# EAGLE design prod5 (EAGLE 6.5.0)
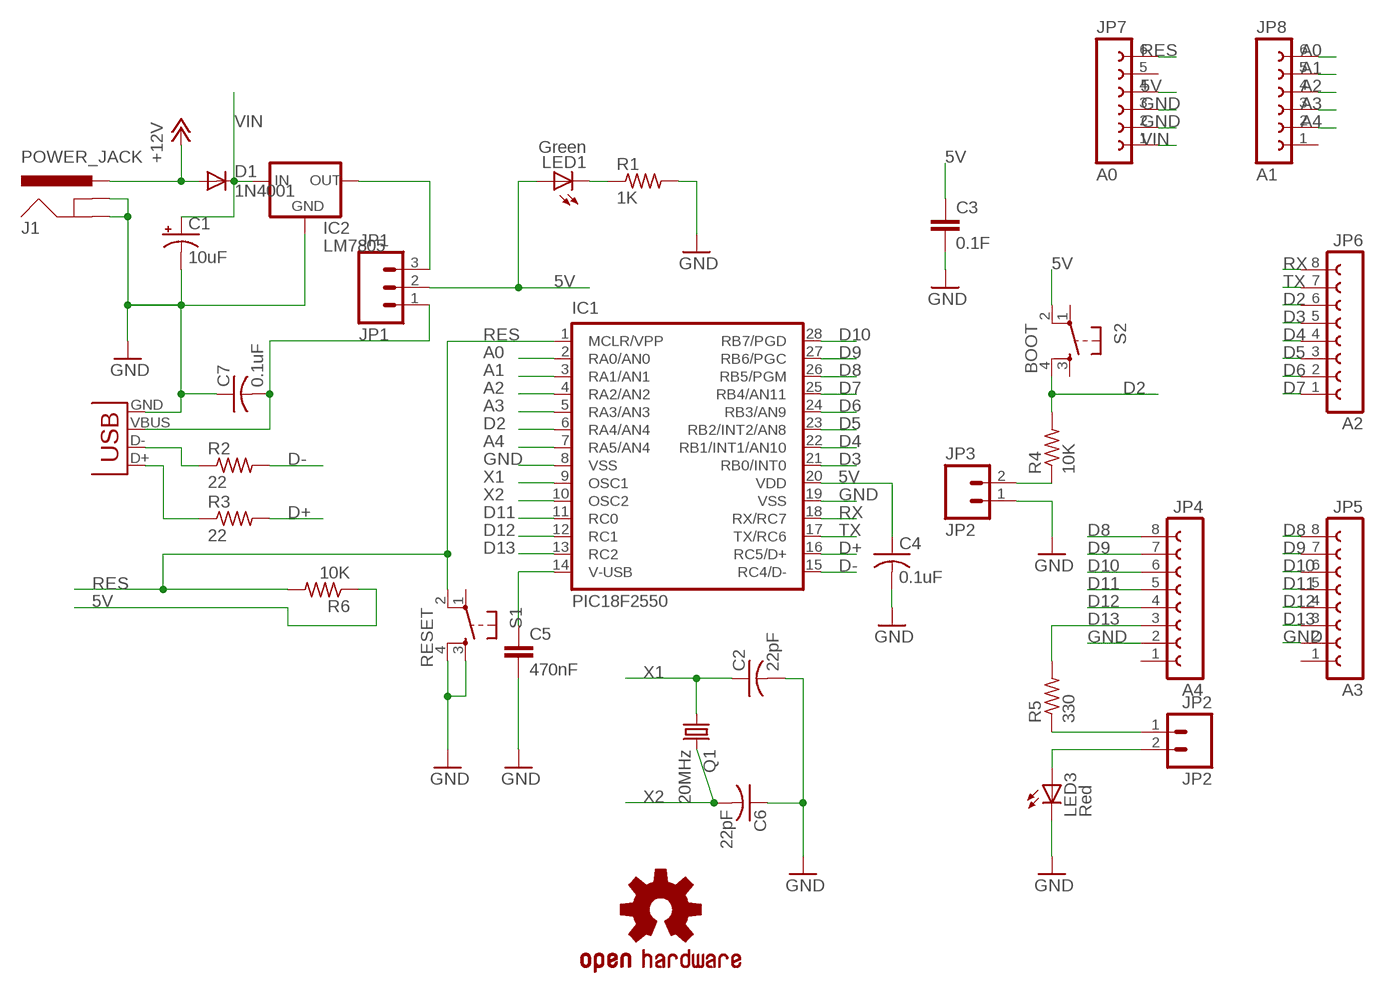
[diagram p0: schematic, sheet 1]

## Parts
C1  10uF  CAP_POLPTH2  [CPOL-RADIAL-10UF-25V]
C2  22pF  C-US025-025X050  [C025-025X050]
C3  0.1F  CAPPTH1  [CAP-PTH-5MM]
C4  0.1uF  C-US025-025X050  [C025-025X050]
C5  470nF  CAPPTH1  [CAP-PTH-5MM]
C6  22pF  C-US025-025X050  [C025-025X050]
C7  0.1uF  C-US025-025X050  [C025-025X050]
D1  1N4001  DIODEPTH  [DIODE-1N4001]
IC1  PIC18F2550  [DIL28-3]
IC2  LM7805  V_REG_78XXSIDE  [78XXL]
J1  POWER_JACK  POWER_JACKPTH  [POWER_JACK_PTH]
JP1  JP1  M03PTH  [1X03]
JP2  JP2  M02PTH  [1X02]
JP3  JP2  M02PTH  [1X02]
JP4  A4  FE08-1  [FE08]
JP5  A3  FE08-1  [FE08]
JP6  A2  FE08-1  [FE08]
JP7  A0  FE06-1  [FE06]
JP8  A1  FE06-1  [FE06]
LED1  Green  LED3MM  [LED3MM]
LED3  Red  LED3MM  [LED3MM]
LOGO1  OSHW-LOGOM  [OSHW-LOGO-M]
Q1  20MHz  CRYSTALHC49S  [HC49/S]
R1  1K  R-US_0204/7  [0204/7]
R2  22  R-US_0207/15  [0207/15]
R3  22  R-US_0207/15  [0207/15]
R4  10K  R-US_0207/15  [0207/15]
R5  330  R-US_0204/7  [0204/7]
R6  10K  R-US_0204/7  [0204/7]
S1  RESET  TAC_SWITCHPTH  [TACTILE-PTH]
S2  BOOT  TAC_SWITCHPTH  [TACTILE-PTH]
X1  USBPTH  [USB-B-PTH]

## Nets
5V: C3.1 C4.1 IC1.20(VDD) JP1.2 JP7.4 LED1.A R6.1 S2.2
+12V: D1.A J1.PWR
A0: IC1.2(RA0/AN0) JP8.6
A1: IC1.3(RA1/AN1) JP8.5
A2: IC1.4(RA2/AN2) JP8.4
A3: IC1.5(RA3/AN3) JP8.3
A4: IC1.7(RA5/AN4) JP8.2
D2: IC1.6(RA4/AN4) JP6.6 R4.2 S2.4
D3: IC1.21(RB0/INT0) JP6.5
D4: IC1.22(RB1/INT1/AN10) JP6.4
D5: IC1.23(RB2/INT2/AN8) JP6.3
D6: IC1.24(RB3/AN9) JP6.2
D7: IC1.25(RB4/AN11) JP6.1
D8: IC1.26(RB5/PGM) JP4.8 JP5.8
D9: IC1.27(RB6/PGC) JP4.7 JP5.7
D10: IC1.28(RB7/PGD) JP4.6 JP5.6
D11: IC1.11(RC0) JP4.5 JP5.5
D12: IC1.12(RC1) JP4.4 JP5.4
D13: IC1.13(RC2) JP4.3 JP5.3 R5.2
D+: IC1.16(RC5/D+) R3.2
D-: IC1.15(RC4/D-) R2.2
GND: C1.2(-) C2.2 C3.2 C4.2 C5.2 C6.1 C7.1 IC1.8(VSS) IC1.19(VSS) IC2.GND J1.GND J1.GNDBREAK JP3.1 JP4.2 JP5.2 JP7.2 JP7.3 LED3.K(C) R1.2 S1.3 S1.4 X1.GND
N$1: JP3.2 R4.1
N$2: LED1.K(C) R1.1
N$4: C7.2 JP1.1 X1.VBUS
N$5: R2.1 X1.D-
N$6: R3.1 X1.D+
N$8: JP2.1 R5.1
N$10: JP2.2 LED3.A
N$11: IC2.OUT JP1.3
N$15: C5.1 IC1.14(V-USB)
RES: IC1.1(MCLR/VPP) JP7.6 R6.2 S1.2
RX: IC1.18(RX/RC7) JP6.8
TX: IC1.17(TX/RC6) JP6.7
VIN: C1.1(+) D1.C IC2.IN JP7.1
X1: C2.1 IC1.9(OSC1) Q1.1
X2: C6.2 IC1.10(OSC2) Q1.2
Unconnected: JP4.1 JP5.1 JP7.5 JP8.1 S1.1 S2.1 S2.3

## Library data of the parts
C1 = SparkFun:CAP_POL: Capacitor Polarized These are standard SMD and PTH capacitors. Normally 10uF, 47uF, and 100uF in electrolytic and tantalum varieties. Always verify the external diameter of the through hole cap, it varies with capacity, voltage, and manufacturer. The EIA devices should be standard.
C2 C4 C6 C7 = rcl:C-US: CAPACITOR, American symbol
C3 C5 = SparkFun:CAP: Capacitor Standard 0603 ceramic capacitor, and 0.1" leaded capacitor.
D1 = SparkFun:DIODE: Diode These are standard reverse protection diodes and small signal diodes. SMA package can handle up to about 1A. SOD-323 can handle about 200mA. What the SOD-323 package when ordering, there are some mfgs out there that are 5-pin packages.
IC1 = SparkFun:PIC18F2550
IC2 = SparkFun:V_REG_78XX: Voltage Regulator Standard 7805 5V regulator. IGO (Input Ground Output). Spark Fun Electronics SKU : COM-00107
J1 = SparkFun:POWER_JACK: Power Jack This is the standard 5.5mm barrel jack for power. The PTH is the most common, proven, reliable, footprint. All others are experimental. The Slot footprint only works if the mill layer is transmitted to the PCB fab house so be warned. Spark Fun Electronics SKU : PRT-00119. Mating wall wart : TOL-00298 (and others)
JP1 = SparkFun-Connectors:M03: Header 3 Standard 3-pin 0.1" header. Use with straight break away headers (SKU : PRT-00116), right angle break away headers (PRT-00553), swiss pins (PRT-00743), machine pins (PRT-00117), and female headers (PRT-00115). Molex polarized connector foot print use with SKU : PRT-08232 with associated crimp pins and housings.
JP2 JP3 = SparkFun-Connectors:M02: Standard 2-pin 0.1" header. Use with - straight break away headers ( PRT-00116) - right angle break away headers (PRT-00553) - swiss pins (PRT-00743) - machine pins (PRT-00117) - female headers (PRT-00115) Molex polarized connector foot print use with: PRT-08233 with associated crimp pins and housings. 2.54_SCREWTERM for use with PRT-10571. 3.5mm Screw Terminal footprints for PRT-08084 5mm Screw Terminal footprints for use with PRT-08433
JP4-JP6 = con-lsta:FE08-1: FEMALE HEADER
JP7 JP8 = con-lsta:FE06-1: FEMALE HEADER
LED1 LED3 = SparkFun:LED: LEDs Standard schematic elements and footprints for 5mm, 3mm, 1206, and 0603 sized LEDs. 5mm - Spark Fun Electronics SKU : COM-00529 (and others)
LOGO1 = SparkFun-Aesthetics:OSHW-LOGO: Open Source Hardware Logo This logo indicates the piece of hardware it is found on incorporates a OSHW license and/or adheres to the definition of open source hardware found here: http://freedomdefined.org/OSHW
Q1 = crystal:CRYSTAL: CRYSTAL; OC_FARNELL: 1667008; OC_NEWARK: unknown
R1-R6 = rcl:R-US_: RESISTOR, American symbol
S1 S2 = SparkFun:TAC_SWITCH: Momentary Switch Button commonly used for reset or general input. Spark Fun Electronics SKU : COM-00097
X1 = SparkFun:USB: USB Connectors USB-B-PTH is fully proven SKU : PRT-00139 USB-miniB is fully proven SKU : PRT-00587 USB-A-PCB is untested. USB-A-H is throughly reviewed, but untested. Spark Fun Electronics SKU : PRT-00437 USB-B-SMT is throughly reviewed, but untested. Needs silkscreen touching up. USB-A-S has not been used/tested USB-MB-H has not been used/tested

## Board
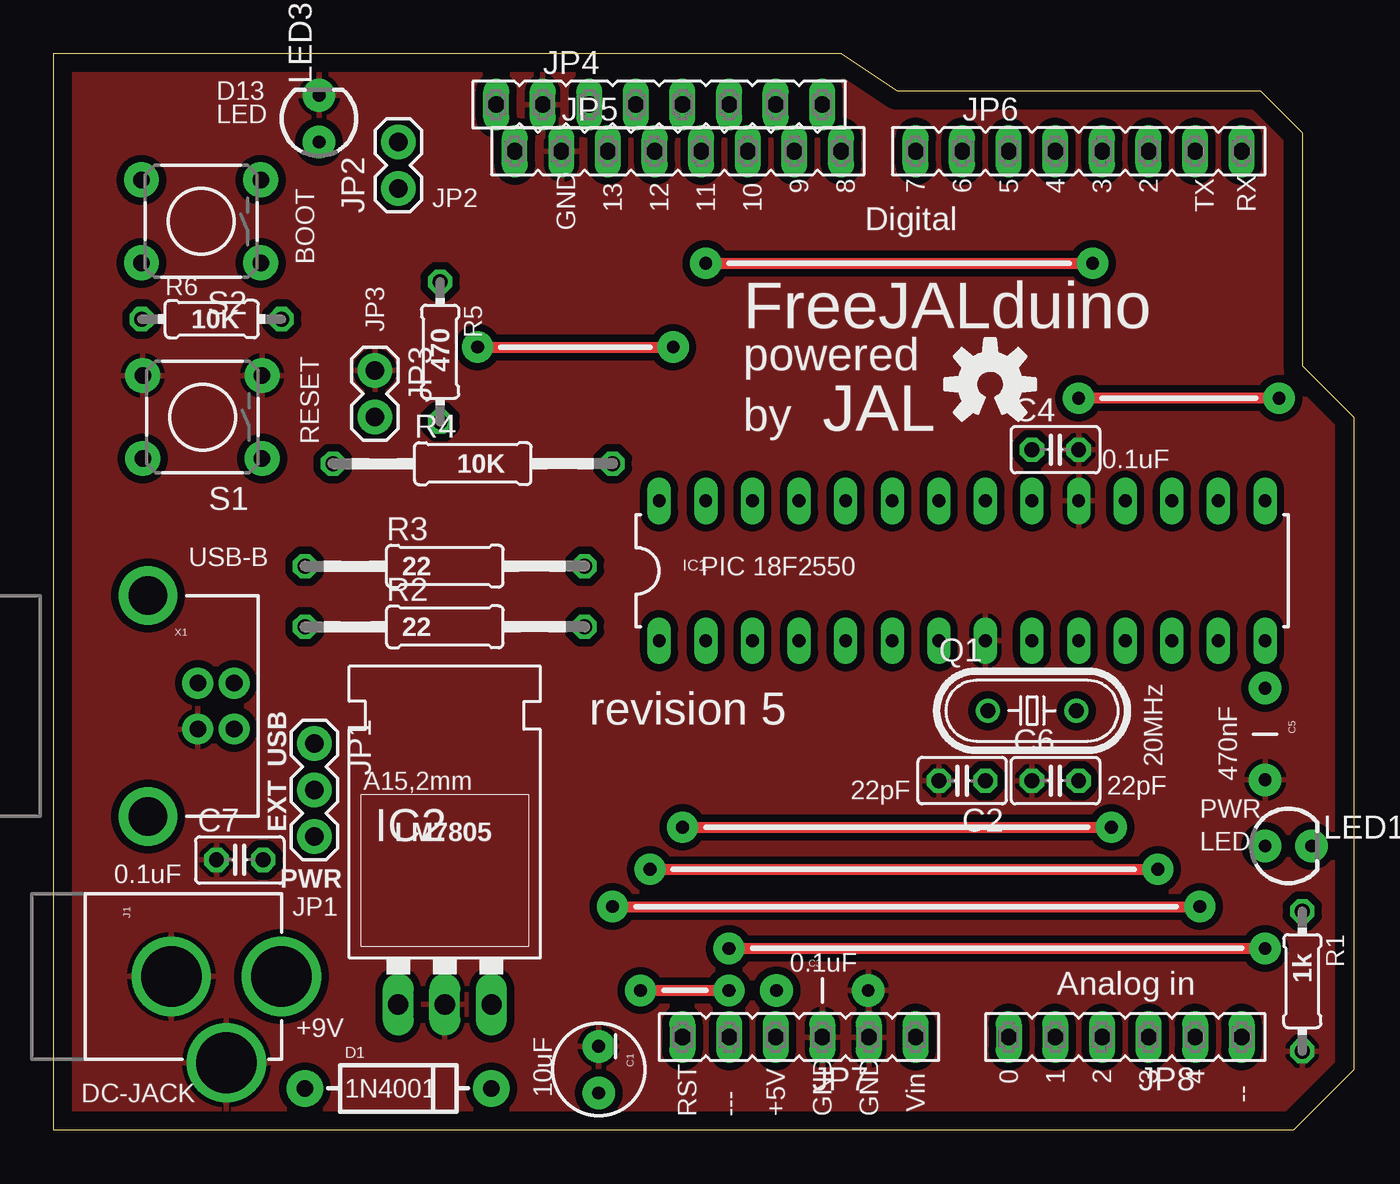
[diagram p1: board, top side]
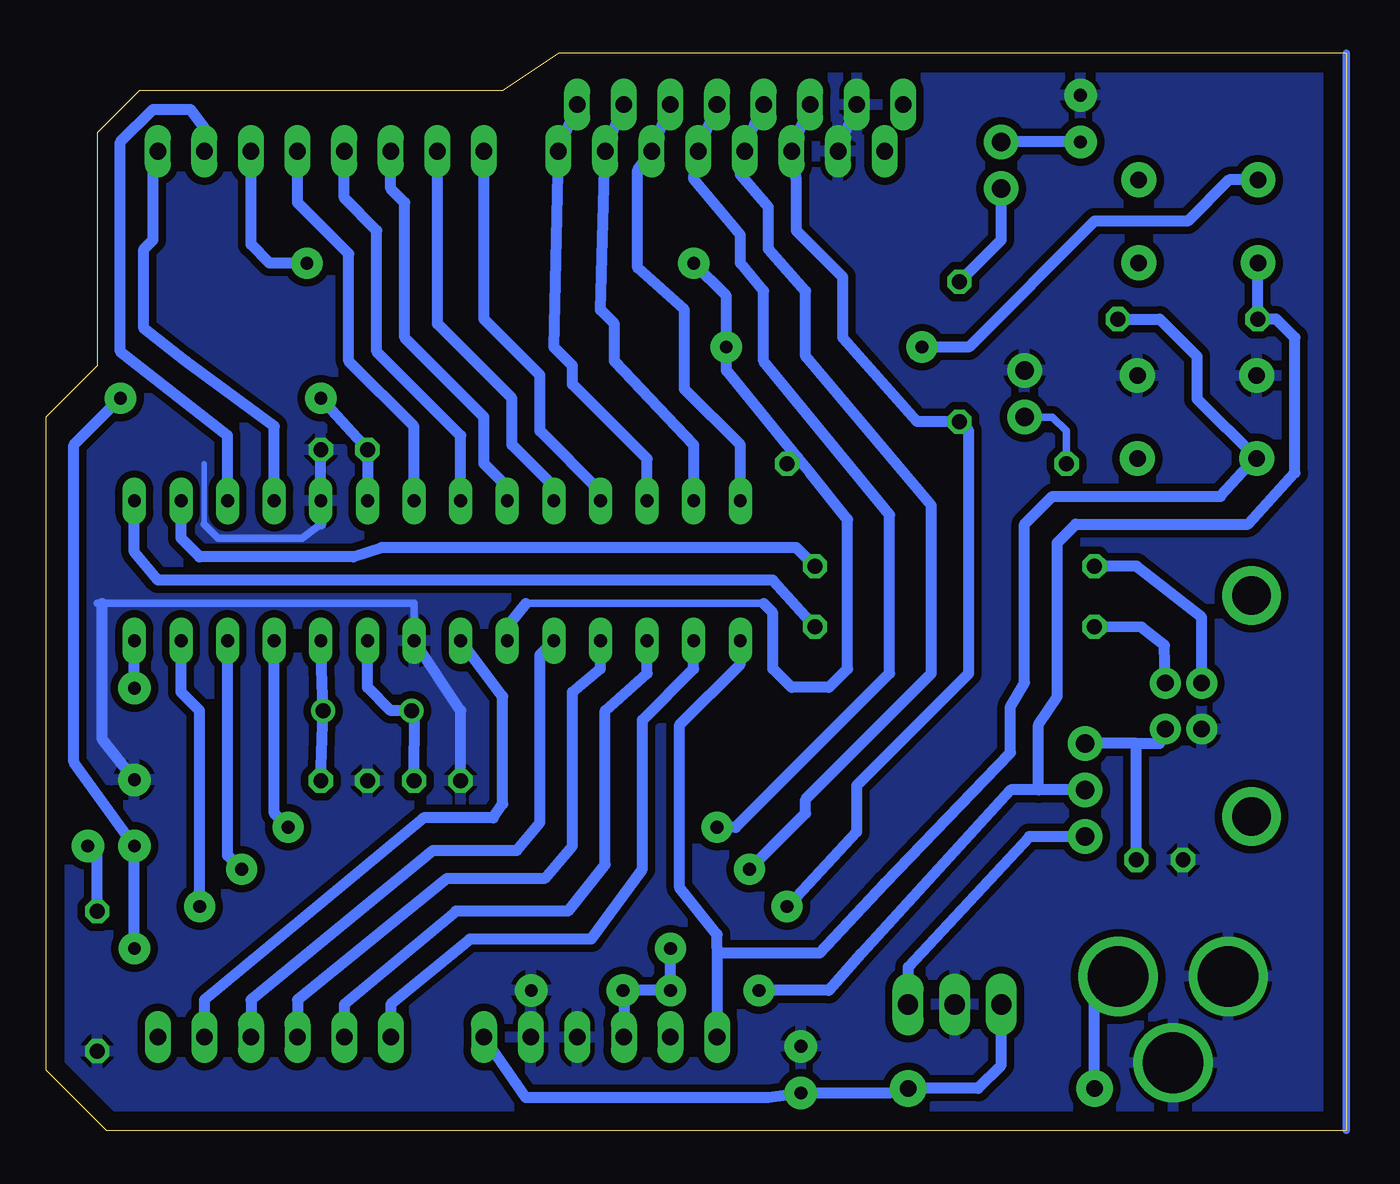
[diagram p2: board, bottom side, seen from below]

Size 70.87 x 58.67 mm. Coordinates in mm from the lower left corner, seen from the top.
Outline: 0,58.67 0,0 67.56,0 70.87,3.3 70.87,38.86 68.07,41.66 68.07,54.36 65.79,56.64 45.97,56.64 42.93,58.67 0,58.67
Copper layers (1*16): Top 0.035mm / dielectric 1.5mm / Bottom 0.035mm
Design rules "10mils *": minimum track width 10mil, minimum drill 24mil, track to track 16mil, track to pad 16mil, pad to pad 16mil, via to via 16mil, smd to smd 10mil, copper to edge 40mil, drill to drill 10mil, minimum pad ring 10mil, minimum via ring 8mil, stop-mask expansion 0mil, vias tented up to drill 0mil, thermal gap 10mil

### Footprints (pad centres in the part's own frame; a part is rotated, then mirrored left to right if it is on the bottom)
CPOL-RADIAL-10UF-25V = drill 0.7 pad 1.778: 1 1.27,0; 2 -1.27,0
C025-025X050 = drill 0.813 octagon: 1 -1.27,0; 2 1.27,0
CAP-PTH-5MM = drill 0.7 pad 1.778: 1 -2.5,0; 2 2.5,0
DIODE-1N4001 = drill 0.9 pad 1.981: A -5.08,0; C 5.08,0
DIL28-3 = drill 0.7 pad 1.27 long: 1 -16.51,-3.81; 2 -13.97,-3.81; 3 -11.43,-3.81; 4 -8.89,-3.81; 5 -6.35,-3.81; 6 -3.81,-3.81; 7 -1.27,-3.81; 8 1.27,-3.81; 9 3.81,-3.81; 10 6.35,-3.81; 11 8.89,-3.81; 12 11.43,-3.81; 13 13.97,-3.81; 14 16.51,-3.81; 15 16.51,3.81; 16 13.97,3.81; 17 11.43,3.81; 18 8.89,3.81; 19 6.35,3.81; 20 3.81,3.81; 21 1.27,3.81; 22 -1.27,3.81; 23 -3.81,3.81; 24 -6.35,3.81; 25 -8.89,3.81; 26 -11.43,3.81; 27 -13.97,3.81; 28 -16.51,3.81
78XXL = drill 1.1 pad 1.676 long: GND 0,-3.81; IN -2.54,-3.81; OUT 2.54,-3.81
POWER_JACK_PTH = drill 3.3 pad 4: GND 0,7.7; GNDBREAK 4.7,10.7; PWR 0,13.7
1X03 = drill 1.016 pad 1.88: 1 -2.54,0; 2 0,0; 3 2.54,0
1X02 = drill 1.016 pad 1.88: 1 -1.27,0; 2 1.27,0
FE08 = drill 0.9 pad 1.422 long: 1 -8.89,0; 2 -6.35,0; 3 -3.81,0; 4 -1.27,0; 5 1.27,0; 6 3.81,0; 7 6.35,0; 8 8.89,0
FE06 = drill 0.9 pad 1.422 long: 1 -6.35,0; 2 -3.81,0; 3 -1.27,0; 4 1.27,0; 5 3.81,0; 6 6.35,0
LED3MM = drill 0.7 pad 1.778: A -1.27,0; K 1.27,0
HC49/S = drill 0.813: 1 -2.413,0; 2 2.413,0
0204/7 = drill 0.813 octagon: 1 -3.81,0; 2 3.81,0
0207/15 = drill 0.813 octagon: 1 -7.62,0; 2 7.62,0
TACTILE-PTH = drill 0.9 pad 1.9: 1 -3.251,2.261; 2 3.251,2.261; 3 -3.251,-2.261; 4 3.251,-2.261
USB-B-PTH = drill 0.9 pad 1.676: D+ 0,1.25; D- 1.981,1.25; GND 0,-1.25; VBUS 1.981,-1.25 | drill 2.1 pad 3.2: P$1 -2.718,-6.02; P$2 -2.718,6.02

### Placement (x,y rotation side)
C1  29.72,3.3 270 top
C2  49.53,19.05 180 top
C3  41.91,7.62 0 top
C4  54.61,37.08 0 top
C5  66.04,21.59 270 top
C6  54.61,19.05 0 top
C7  10.16,14.73 0 top
D1  18.8,2.29 0 top
IC1  49.53,30.48 0 top
IC2  21.34,10.67 0 top
J1  -1.27,8.38 270 top
JP1  14.22,18.54 270 top
JP2  18.8,52.58 90 top
JP3  17.53,40.13 270 top
JP4  33.02,55.88 0 top
JP5  34.04,53.34 0 top
JP6  55.88,53.34 0 top
JP7  40.64,5.08 180 top
JP8  58.42,5.08 180 top
LED1  67.31,15.49 0 top
LED3  14.48,55.12 90 top
LOGO1  51.05,40.64 0 top
Q1  53.34,22.86 0 top
R1  68.07,8.13 270 top
R2  21.34,27.43 0 top
R3  21.34,30.73 0 top
R4  22.86,36.32 0 top
R5  21.08,42.42 270 top
R6  8.64,44.2 0 top
S1  8.13,38.86 180 top
S2  8.05,49.52 180 top
X1  7.87,23.11 0 top

### Tracks (layer width: path | path; a pad name or v marks a point on that pad's centre or on a via)
5V  (via drill 0.7 pad 1.7)
  Top 0.61: C3.1 39.62,7.62 | v32,7.62 v36.83,7.62 | v36.83,9.91 v66.04,9.91 | v66.8,39.88 v55.88,39.88
  Bottom 0.61: IC1.20 C4.1 v55.88,39.88 | JP7.4 39.37,7.58 C3.1 v36.83,7.62 v36.83,9.91 | 16.76,18.54 16.76,22.1 15.75,23.62 15.75,32 14.73,33.02 5.33,33.02 2.79,35.81 2.79,43.18 3.81,44.2 R6.1 4.83,47.23 S2.2 | JP1.2 16.76,18.54 | 16.76,18.54 18.29,18.54 26.42,9.65 28.19,7.62 v32,7.62 | v66.04,9.91 LED1.A 69.34,20.07 69.34,37.34 v66.8,39.88
+12V
  Bottom 0.61: J1.PWR 12.43,8.4 13.72,7.11 D1.A
A0
  Bottom 0.61: IC1.2 35.56,25.15 38.35,22.35 38.35,14.22 41.15,10.41 47.75,10.41 52.07,6.86 JP8.6
A1
  Bottom 0.61: IC1.3 38.1,24.89 40.39,22.86 40.39,14.48 42.42,11.94 48.51,11.94 54.61,6.86 JP8.5
A2
  Bottom 0.61: IC1.4 40.64,25.15 42.16,23.88 42.16,15.49 43.69,13.72 49.02,13.72 57.15,7.11 JP8.4
A3
  Bottom 0.61: JP8.3 59.69,7.11 49.78,15.24 45.21,15.24 43.94,16.76 43.94,25.91 IC1.5
A4
  Bottom 0.61: IC1.7 45.97,23.62 45.97,17.78 46.48,17.02 50.29,17.02 62.23,7.11 JP8.2
D2  (via drill 0.7 pad 1.7)
  Top 0.61: v35.56,47.24 v56.64,47.24 | v23.11,42.67 v33.78,42.67
  Bottom 0.406: 31.75,28.7 44.7,28.7
  Bottom 0.61: IC1.6 45.72,27.43 44.7,28.7 | 31.75,28.7 31.24,28.19 31.24,25.15 30.23,24.13 28.19,24.13 27.18,25.15 27.18,33.27 29.21,35.81 29.87,36.62 | v35.56,47.24 33.78,45.47 v33.78,42.67 33.78,41.4 29.87,36.62 | v56.64,47.24 58.67,47.24 59.69,48.26 JP6.6 | R4.2 30.16,36.32 29.87,36.62 | S2.4 6.39,51.78 8.64,49.53 13.72,49.53 20.57,42.67 v23.11,42.67
D3
  Bottom 0.61: IC1.21 50.8,38.35 54.36,41.91 54.36,47.75 57.15,50.55 JP6.5
D4
  Bottom 0.61: IC1.22 48.26,37.85 52.83,42.42 52.83,49.02 54.61,50.8 JP6.4
D5
  Bottom 0.61: IC1.23 45.72,35.05 46.99,36.32 46.99,38.86 51.31,43.18 51.31,50.55 52.07,51.31 JP6.3
D6
  Bottom 0.61: IC1.24 43.18,35.05 45.47,37.34 45.47,39.88 49.53,43.94 JP6.2
D7
  Bottom 0.61: IC1.25 40.64,34.8 43.94,38.1 43.94,41.15 46.99,44.2 JP6.1
D8
  Bottom 0.61: IC1.26 38.1,36.58 42.16,40.64 42.16,41.66 43.18,42.67 JP5.8 JP4.8
D9
  Bottom 0.61: IC1.27 35.56,37.34 39.88,41.91 39.88,43.94 40.64,44.7 JP5.7 JP4.7
D10
  Bottom 0.61: IC1.28 33.02,37.34 36.07,40.39 36.07,44.7 38.61,46.99 38.61,52.32 JP5.6 JP4.6
D11  (via drill 0.7 pad 1.7)
  Top 0.61: v34.29,16.51 v57.66,16.51
  Bottom 0.61: IC1.11 58.42,17.27 v57.66,16.51 | v34.29,16.51 33.27,16.51 24.89,24.89 24.89,33.53 31.75,41.91 31.75,45.72 33.02,47.24 33.02,48.77 35.56,51.82 JP5.5 JP4.5
D12  (via drill 0.7 pad 1.7)
  Top 0.61: v32.51,14.22 v60.2,14.22
  Bottom 0.61: 32.63,53.93 JP5.4 33.02,52.07 31.5,50.29 31.5,48.01 29.46,45.72 29.46,42.16 22.61,34.04 22.61,24.89 29.46,18.03 29.46,17.27 v32.51,14.22 | 32.63,53.93 32.51,54.1 | IC1.12 60.96,14.99 v60.2,14.22 | 32.63,53.93 JP4.4
D13  (via drill 0.7 pad 1.7)
  Top 0.61: v30.48,12.19 v62.48,12.19
  Bottom 0.61: IC1.13 63.5,23.88 62.48,22.86 v62.48,12.19 | v30.48,12.19 29.97,12.7 26.67,16.26 26.67,18.8 20.57,24.89 20.57,38.1 R5.2 | R5.2 21.2,38.7 21.2,38.61 | 21.2,38.61 23.37,38.61 27.43,43.18 27.43,46.48 29.97,49.02 29.97,51.82 JP5.3 JP4.3 | R5.2 21.2,38.61
D+
  Bottom 0.61: IC1.16 63.5,32.26 62.48,31.24 54.1,31.24 52.58,31.75 29.97,31.75 R3.2
D-
  Bottom 0.61: R2.2 31.24,29.97 64.77,29.97 66.04,31.5 IC1.15
GND
  Bottom 0.305: 62.23,33.02 62.23,36.32
  Bottom 0.406: 55.88,33.02 56.9,32.26 61.47,32.26 62.23,33.02 | IC1.8 50.8,28.7 67.82,28.7 68.07,28.7
  Bottom 0.61: 55.88,33.02 IC1.19 C4.2 | JP7.2 44.41,5.08 | JP5.2 JP4.2 | IC2.GND 21.34,8.13 | 66.04,19.05 C5.2 67.82,21.34 67.82,28.7 | C2.2 48.26,22.86 IC1.8
  pour Bottom (isolate 0.406, hatched): 1.52,0.51 1.52,57.66 70.1,57.66 70.1,3.56 67.06,0.51
  pour Top: 0,58.93 70.36,58.93 70.36,0 0,0
N$1
  Bottom 0.406: R4.1 15.24,38.1 16,38.86 JP3.2
N$2
  Bottom 0.61: R1.1 68.07,15.24 LED1.K
N$4
  Bottom 0.61: 9.91,21.66 X1.VBUS 10.16,21.08 11.43,21.08 | 11.43,21.08 JP1.1 | C7.2 11.43,21.08
N$5
  Bottom 0.61: X1.D- 9.91,26.42 11.16,27.41 R2.1
N$6
  Bottom 0.61: X1.D+ 7.87,27.94 11.43,30.73 R3.1
N$8
  Bottom 0.61: R5.1 18.8,48.51 JP2.1
N$10
  Bottom 0.61: LED3.A JP2.2
N$11
  Bottom 0.61: IC2.OUT 23.88,8.89 17.27,16 JP1.3
N$12
  Bottom 0.406: 0,0 0,58.67
N$15
  Bottom 0.61: C5.1 IC1.14
RES
  Bottom 0.61: IC1.1 33.02,25.4 36.32,22.1 36.32,13.21 34.29,10.67 34.29,9.91 | 34.29,9.91 JP7.6 | 34.29,9.91 34.04,9.65 28.7,9.65 25.15,13.46 18.29,20.57 18.29,23.11 17.53,24.38 17.53,33.02 16,34.54 6.86,34.54 5.03,36.52 S1.2 8.13,39.85 8.13,42.16 10.16,44.2 R6.2
RX
  Bottom 0.61: IC1.18 58.42,38.35 63.25,41.91 65.53,43.69 65.53,48.01 65.02,48.51 65.02,53.09 JP6.8
TX
  Bottom 0.61: IC1.17 60.96,37.85 66.8,42.42 66.8,53.85 65.02,55.63 62.99,55.63 62.23,54.61 JP6.7
VIN
  Bottom 0.61: IC2.IN 18.8,3.56 20.07,2.29 D1.C 24.89,2.03 C1.1 31.5,1.78 44.7,1.78 JP7.1
X1
  Bottom 0.61: IC1.9 53.34,24.13 52.07,22.86 Q1.1 50.76,22.82 C2.1
X2
  Bottom 0.61: C6.2 Q1.2 IC1.10

### Text on the board
tPlace: D13 | LED | BOOT | JP2 | 9 | 8 | 7 | 6 | 5 | 4 | 3 | 2 | 13 | 12 | 11 | 10 | Digital | TX | RX | GND | JP3 | 10K | 470 | FreeJALduino | RESET | powered | by | JAL | 10K | 0.1uF | USB-B | 22 | PIC 18F2550 | 22 | revision 5 | USB | 20MHz | 470nF | 22pF | 22pF | LM7805 | PWR | EXT | LED | PWR | 0.1uF | JP1 | 1k | 0.1uF | Analog in | +9V | 10uF | 0 | 1 | 2 | 3 | 4 | DC-JACK | -- | RST | --- | +5V | GND | GND | Vin